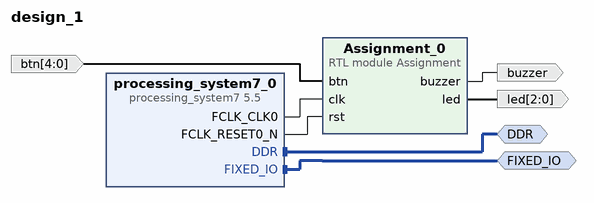
[diagram p0: block diagram of the top level]
# Vivado block design design_1, xc7z010clg400-1, Vivado 2022.1
create_bd_design design_1

create_bd_intf_port -mode Master -vlnv xilinx.com:interface:ddrx_rtl:1.0 DDR
create_bd_intf_port -mode Master -vlnv xilinx.com:display_processing_system7:fixedio_rtl:1.0 FIXED_IO
create_bd_port -dir I -from 4 -to 0 btn
create_bd_port -dir O buzzer
create_bd_port -dir O -from 2 -to 0 led

create_bd_cell -type ip -vlnv xilinx.com:ip:processing_system7:5.5 processing_system7_0
set_property -dict {CONFIG.PCW_USE_M_AXI_GP0 0} [get_bd_cells processing_system7_0]
# 1 more settings of processing_system7_0 are not shown: defaults, MIO pin electricals, DDR timing, and values the tool derives
create_bd_cell -type module -reference Assignment Assignment_0

# ---- connections ----

connect_bd_intf_net [get_bd_intf_ports DDR] [get_bd_intf_pins processing_system7_0/DDR]
connect_bd_intf_net [get_bd_intf_ports FIXED_IO] [get_bd_intf_pins processing_system7_0/FIXED_IO]
connect_bd_net [get_bd_pins Assignment_0/buzzer] [get_bd_ports buzzer]
connect_bd_net [get_bd_pins Assignment_0/led] [get_bd_ports led]
connect_bd_net [get_bd_ports btn] [get_bd_pins Assignment_0/btn]
connect_bd_net [get_bd_pins processing_system7_0/FCLK_CLK0] [get_bd_pins Assignment_0/clk]
connect_bd_net [get_bd_pins processing_system7_0/FCLK_RESET0_N] [get_bd_pins Assignment_0/rst]

validate_bd_design
save_bd_design
